# Altium schematic sheet Encoder.SchDoc: Encoder
size OrCAD A; DocumentNumber: LM-004; Revision: B; SheetNumber: 2; SheetTotal: 4
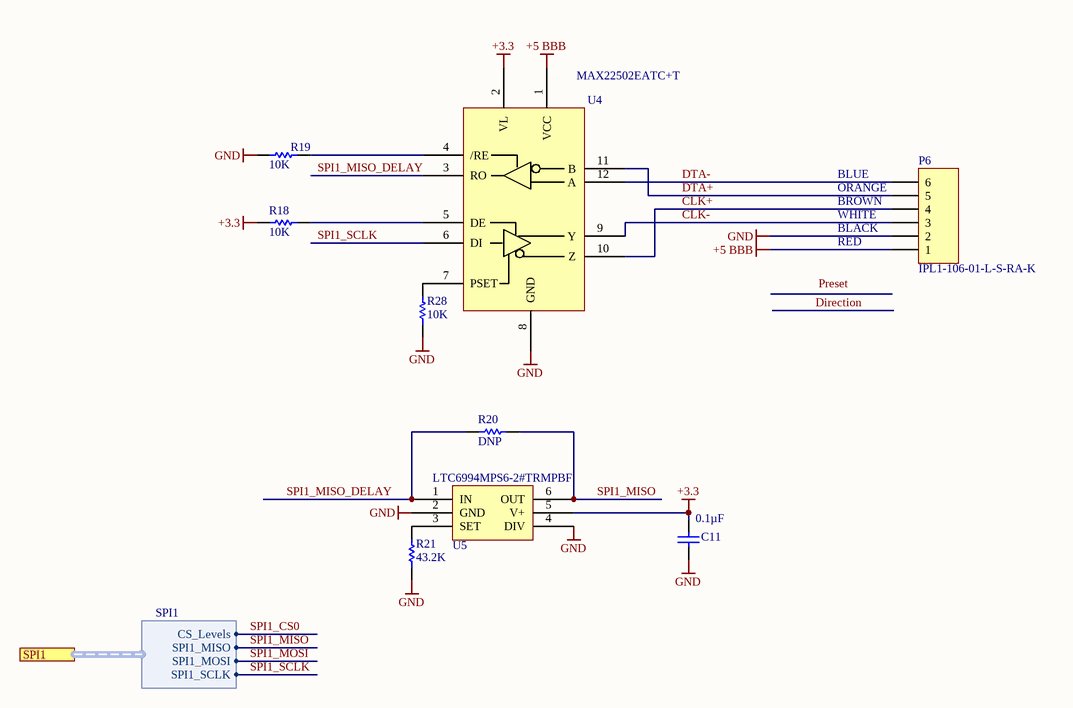
[diagram p0: Encoder.SchDoc]

## Parts
C11  Capacitance: 0.1µF  [CAPC0805(2012)145_N]  (hidden comment: CAP CER 0.1UF 25V X7R 0805)
P6  IPL1-106-01-L-S-RA-K  [IPL1-106-01-L-S-RA-K]
R18  10K  [RESC0805(2012)_L]
R19  10K  [RESC0805(2012)_L]
R20  DNP  [RESC0805(2012)_L]
R21  43.2K  [RESC0805(2012)_L]
R28  10K  [RESC0805(2012)_L]
U4  MAX22502EATC+T  [MAX22502EATC+T]
U5  LTC6994MPS6-2#TRMPBF  [LTC6994MPS6-2#TRMPBF]

## Ports
SPI1 (harness SPI1)

## Harnesses
SPI1: CS_Levels, SPI1_MISO, SPI1_MOSI, SPI1_SCLK

## Nets
+3.3: C11.1 R18.2 U4.2(VL) U5.5(V+)
+5 BBB: P6.1 U4.1(VCC)
GND: C11.2 P6.2 R19.2 R21.2 R28.2 U4.8(GND) U5.2(GND) U5.4(DIV)
CLK+: P6.4 U4.10(Z)
CLK-: P6.3 U4.9(Y)
DTA+: P6.5 U4.11(B)
DTA-: P6.6 U4.12(A)
SPI1_CS0: port SPI1.CS_Levels
SPI1_MISO: R20.2 U5.6(OUT) ; port SPI1.SPI1_MISO
SPI1_MISO_DELAY: R20.1 U4.3(RO) U5.1(IN)
SPI1_MOSI: port SPI1.SPI1_MOSI
SPI1_SCLK: U4.6(DI) ; port SPI1.SPI1_SCLK
NetR18_1: R18.1 U4.5(DE)
NetR19_1: R19.1 U4.4(/RE)
NetR21_1: R21.1 U5.3(SET)
NetR28_1: R28.1 U4.7(PSET)

## Notes on the sheet
- (near P6) BROWN
- (near P6) WHITE
- (near P6) ORANGE
- BLUE
- RED
- (near P6) BLACK
- Labels drawn without touching a wire or pin: Preset
- Title
- Size:
- Date:
- Orcad A
- Number:
- Time:
- Revision:
- Sheet
- of
- ZLS Corporation
- 7801 North Lamar Blvd.
- Suite E-184
- Austin, Texas 78752  USA
- (512) 453-0288
- File:

## Library data of the parts
C11 = CMP-1036-04795-1: Manufacturer: Murata Electronics North America; Manufacturer Part Number: GRM21BR71E104KA01L; Tolerance: ±10%; Supplier 1: Digi-Key; Supplier Part Number 1: 490-1673-6-ND; RoHS: RoHS Compliant; Category: Capacitors; Stock 1: 891652; Pricing 1: 1=0.2, 10=0.145, 100=0.0683, 500=0.04788, 1000=0.03964 (USD); Packaging: Digi-Reel®; Part Status: Active; Voltage - Rated: 25V; Temperature Coefficient: X7R; Operating Temperature: -55°C ~ 125°C; Features: -; Ratings: -; Applications: General Purpose; Mounting Type: Surface Mount, MLCC; Package / Case: 0805 (2012 Metric); Size / Dimension: 0.079" L x 0.049" W (2.00mm x 1.25mm); Height - Seated (Max): -; Thickness (Max): 0.053" (1.35mm); Lead Spacing: -; Lead Style: -; ComponentLink1URL: http://www.murata.com/~/media/webrenewal/support/library/catalog/products/capacitor/mlcc/c02e.ashx; ComponentLink1Description: http://www.murata.com/~/media/webrenewal/support/library/catalog/products/capacitor/mlcc/c02e.ashx
P6 = Header 6: Header, 6-Pin; Manufacturer: Samtec Inc.; Pitch - Mating: 0.100" (2.54mm); Number of Positions: 6; Number of Positions Loaded: All; Style: Board to Cable/Wire; Shrouding: Shrouded - 4 Wall; Contact Length - Mating: 0.215" (5.46mm); Contact Length - Post: 0.085" (2.16mm); Material Flammability Rating: UL94 V-0; Voltage Rating: 675VAC, 954VDC; Supplier 1: Digi-Key; Supplier Part Number 1: SAM9602-ND; Manufacturer Part Number: IPL1-106-01-L-S-RA-K; RoHS: RoHS Compliant; Category: Connectors, Interconnects; Stock 1: 6; Pricing 1: 1=2.73, 34=2.39794, 102=2.18, 510=1.853, 1020=1.5805, 5032=1.417 (USD); Packaging: Tube; Part Status: Active; Connector Type: Header; Contact Type: Male Pin; Number of Rows: 1; Row Spacing - Mating: -; Mounting Type: Through Hole, Right Angle; Termination: Solder; Fastening Type: Locking Ramp; Overall Contact Length: -; Insulation Height: 0.240" (6.10mm); Contact Shape: Square; Contact Finish - Mating: Gold; Contact Finish Thickness - Mating: 10.0µin (0.25µm); Contact Finish - Post: Tin; Contact Material: Phosphor Bronze; Insulation Material: Liquid Crystal Polymer (LCP); Features: -; Operating Temperature: -55°C ~ 125°C; Ingress Protection: -; Insulation Color: Natural; Current Rating: -; Mated Stacking Heights: -; Contact Finish Thickness - Post: -; Applications: -; ComponentLink1URL: http://suddendocs.samtec.com/prints/ipl1-1xx-xx-xxx-s-xx-x-xx-mkt.pdf; ComponentLink1Description: http://suddendocs.samtec.com/prints/ipl1-1xx-xx-xxx-s-xx-x-xx-mkt.pdf
R18 R19 R28 = CMP-1013-00215-1: RES SMD 10K OHM 1% 1/8W 0805; Manufacturer: Vishay Dale; Manufacturer Part Number: CRCW080510K0FKEA; Power (Watts): 0.125W, 1/8W; Temperature Coefficient: ±100ppm/°C; Supplier 1: Digi-Key; Supplier Part Number 1: 541-10.0KCCT-ND; RoHS: RoHS Compliant; Category: Resistors; Stock 1: 1104982; Pricing 1: 1=0.1, 10=0.055, 100=0.0223, 1000=0.01003, 2500=0.0087 (USD); Packaging: Cut Tape (CT); Part Status: Active; Tolerance: ±1%; Composition: Thick Film; Features: Automotive AEC-Q200; Operating Temperature: -55°C ~ 155°C; Package / Case: 0805 (2012 Metric); Supplier Device Package: 0805; Size / Dimension: 0.079" L x 0.049" W (2.00mm x 1.25mm); Height - Seated (Max): 0.020" (0.50mm); Failure Rate: -; ComponentLink1URL: http://www.vishay.com/docs/20035/dcrcwe3.pdf; ComponentLink1Description: http://www.vishay.com/docs/20035/dcrcwe3.pdf
R20 = CMP-1013-00215-1: RES SMD 0 OHM 5% 1/8W 0805
R21 = CMP-1013-00215-1: RES SMD 43.2K OHM 1% 1/8W 0805; Manufacturer: Vishay Dale; Manufacturer Part Number: CRCW080543K2FKEA; Power (Watts): 0.125W, 1/8W; Temperature Coefficient: ±100ppm/°C; Supplier 1: Digi-Key; Supplier Part Number 1: 541-43.2KCCT-ND; RoHS: RoHS Compliant; Category: Resistors; Stock 1: 68577; Pricing 1: 1=0.1, 10=0.055, 100=0.0223, 1000=0.01003, 2500=0.0087 (USD); Packaging: Cut Tape (CT); Part Status: Active; Tolerance: ±1%; Composition: Thick Film; Features: Automotive AEC-Q200; Operating Temperature: -55°C ~ 155°C; Package / Case: 0805 (2012 Metric); Supplier Device Package: 0805; Size / Dimension: 0.079" L x 0.049" W (2.00mm x 1.25mm); Height - Seated (Max): 0.020" (0.50mm); Failure Rate: -; ComponentLink1URL: http://www.vishay.com/docs/20035/dcrcwe3.pdf; ComponentLink1Description: http://www.vishay.com/docs/20035/dcrcwe3.pdf
U5 = LTC6994MPS6-2#TRMPBF: Manufacturer: Linear Technology/Analog Devices; Manufacturer Part Number: LTC6994CS6-2#TRMPBF; Function: Programmable; Available Total Delays: 1µs ~ 33.6s; Voltage - Supply: 2.25 V ~ 5.5 V; Supplier 1: Digi-Key; Supplier Part Number 1: LTC6994CS6-2#TRMPBFCT-ND; RoHS: RoHS Compliant; Category: Integrated Circuits (ICs); Stock 1: 1401; Pricing 1: 1=3.42, 25=3.0496, 100=1.9217, 250=1.76156 (USD); Packaging: Cut Tape (CT); Part Status: Active; Delay to 1st Tap: -; Operating Temperature: 0°C ~ 70°C; Mounting Type: Surface Mount; Package / Case: SOT-23-6 Thin, TSOT-23-6; Supplier Device Package: TSOT-23-6; Base Part Number: LTC6994; ComponentLink1URL: http://www.linear.com/docs/29725; ComponentLink1Description: http://www.linear.com/docs/29725